# Altium schematic sheet ADC CS ISO.SchDoc
size A4; SheetNumber: 7; SheetTotal: 9
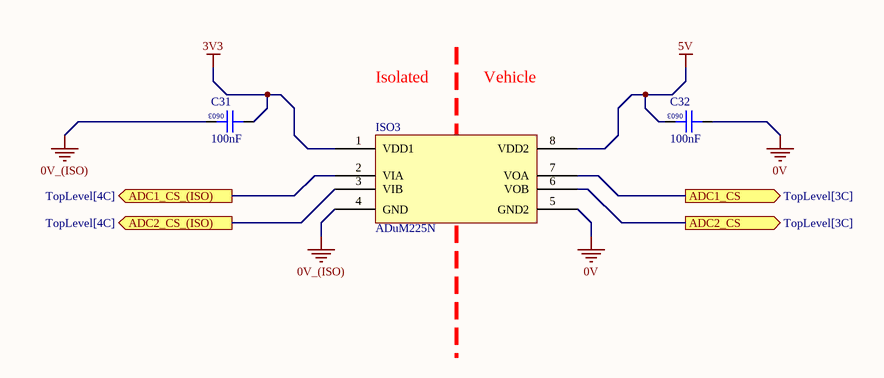
[diagram p0: ADC CS ISO.SchDoc]

## Parts
C31  100nF  [0603]
C32  100nF  [0603]
ISO3  ADuM225N  [AD-SOIC-8W]

## Ports
ADC1_CS (out, see TopLevel[3C]), ADC1_CS_(ISO) (out, see TopLevel[4C]), ADC2_CS (out, see TopLevel[3C]), ADC2_CS_(ISO) (out, see TopLevel[4C])

## Nets
0V: C32.1 ISO3.5(GND2)
0V_(ISO): C31.2 ISO3.4(GND)
3V3: C31.1 ISO3.1(VDD1)
5V: C32.2 ISO3.8(VDD2)
ADC1_CS: ISO3.7(VOA) ; port ADC1_CS
ADC1_CS_(ISO): ISO3.2(VIA) ; port ADC1_CS_(ISO)
ADC2_CS: ISO3.6(VOB) ; port ADC2_CS
ADC2_CS_(ISO): ISO3.3(VIB) ; port ADC2_CS_(ISO)

## Notes on the sheet
- Isolated
- Vehicle
- (in symbol GCM188L81H104KA57D) 0603

## Library data of the parts
C31 C32 = GCM188L81H104KA57D: Manufacturer: muRata; Rated Voltage: 50V; Tolerance: ±10%; Material: MLCC; Temperature Rating: X8L; Part Number: GCM188L81H104KA57D; Value: 100nF; Digikey Part Number: 490-6049-1-ND
ISO3 = ADuM225N: DIGITAL ISOLATOR, DUAL CHANNEL; Manufacturer: Analogue Devices; Complex IC: 0; Part Number: ADuM225N